# EAGLE schematic MesschieberBackup (EAGLE 6.5.0)
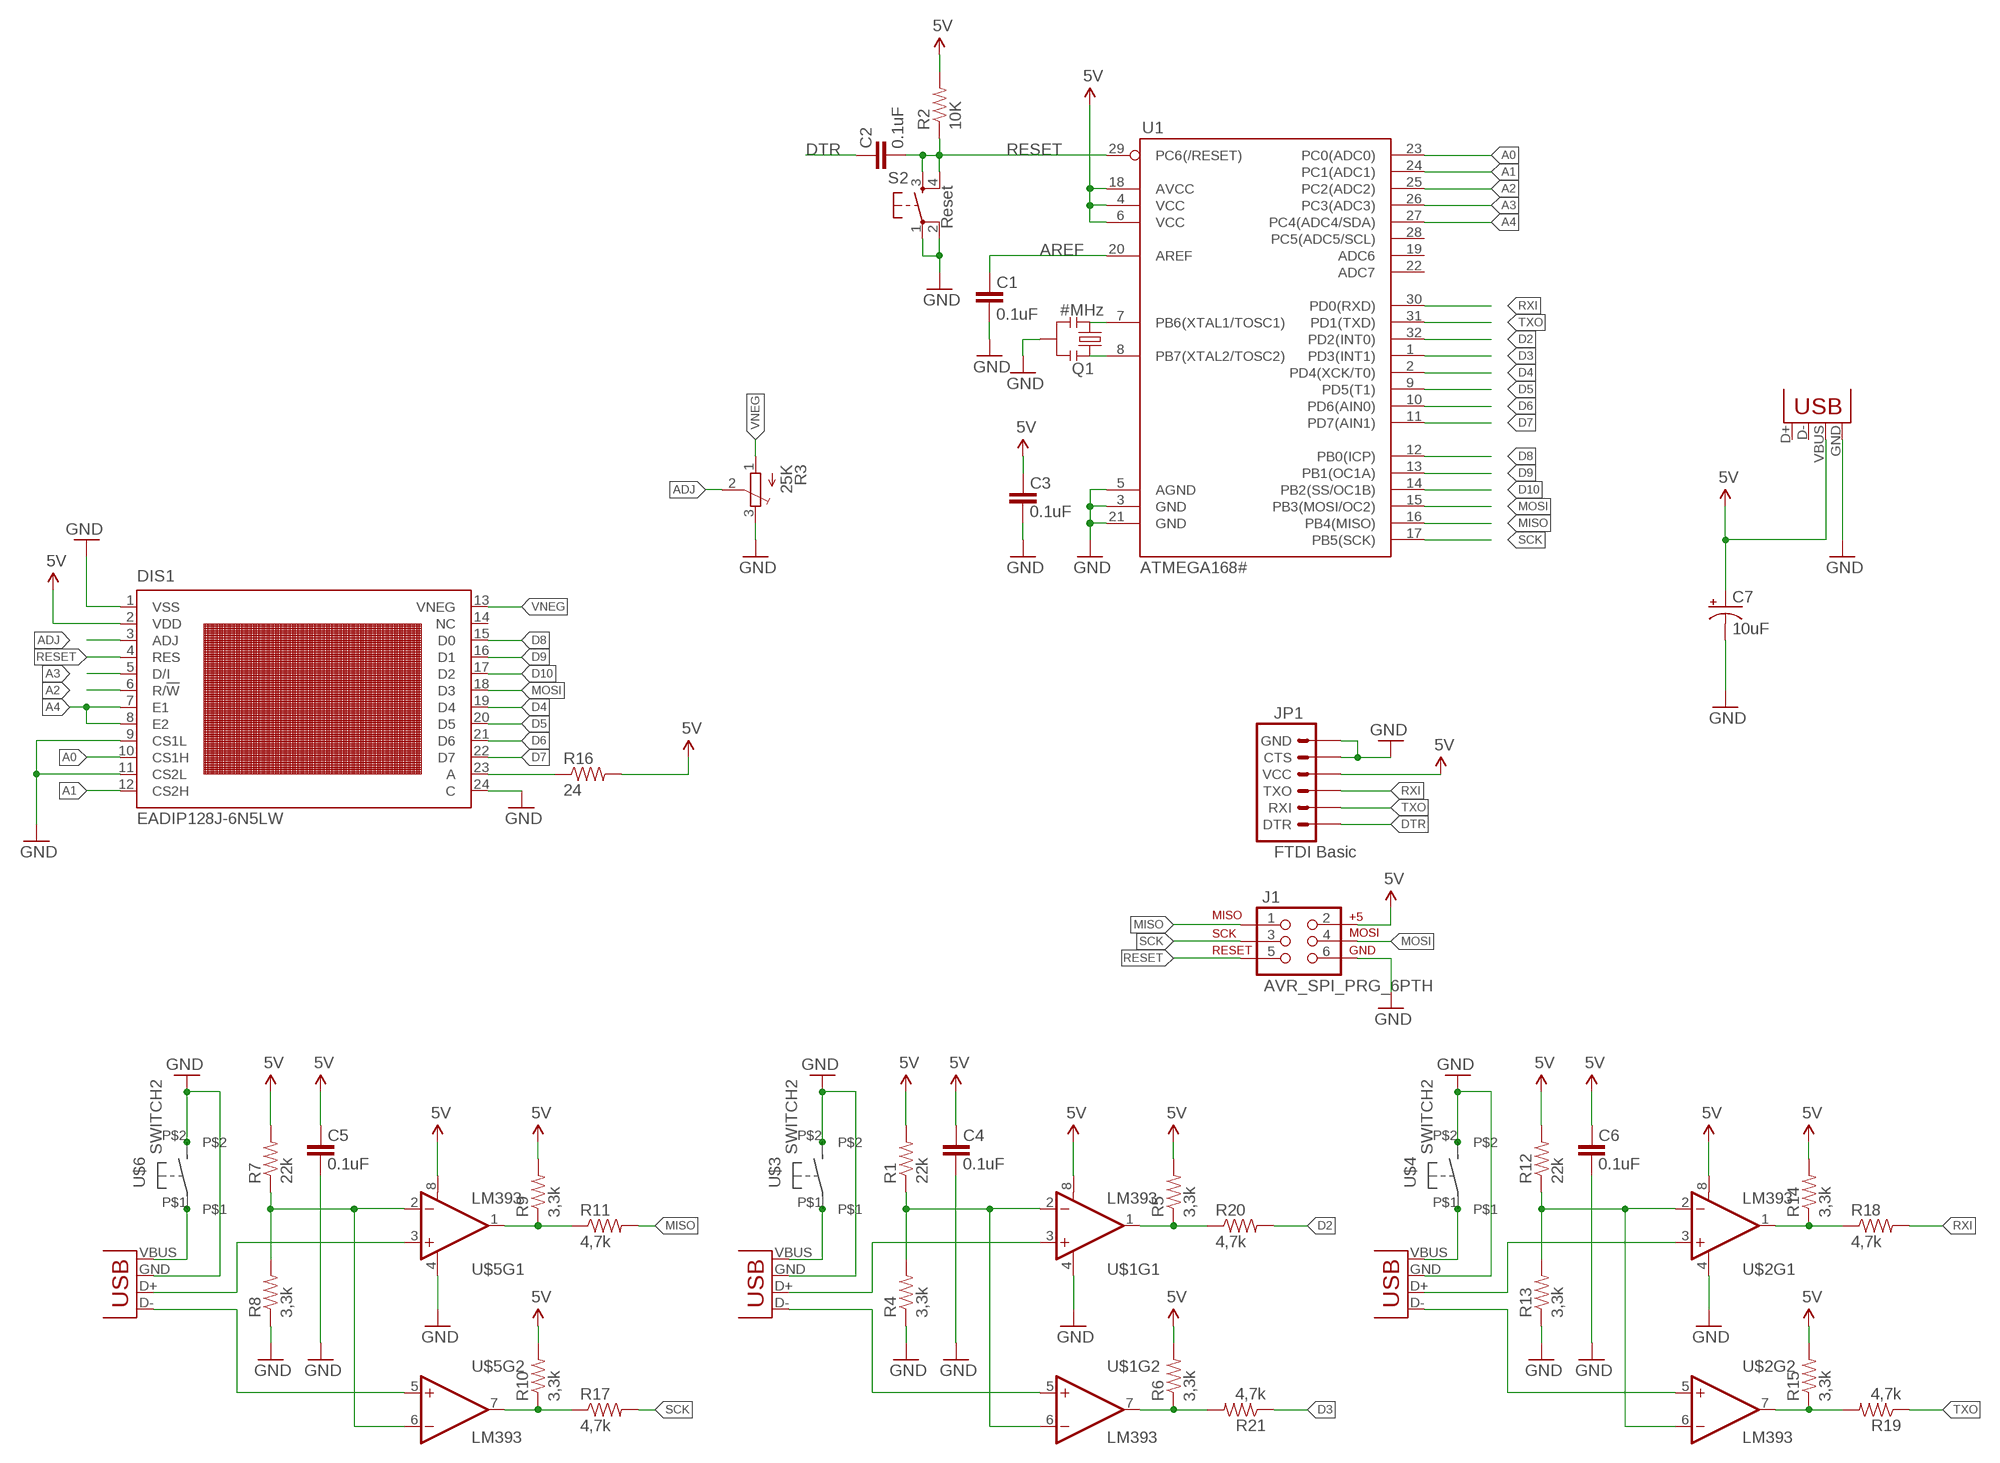
[diagram p0: schematic, sheet 1]

## Parts
C1  0.1uF  CAP0805  [0805]
C2  0.1uF  CAP0805  [0805]
C3  0.1uF  CAP0805  [0805]
C4  0.1uF  CAP0805  [0805]
C5  0.1uF  CAP0805  [0805]
C6  0.1uF  CAP0805  [0805]
C7  10uF  10UF-16V-10%(TANT)  [EIA3216]
DIS1  EADIP128J-6N5LW  [LCD-DIP128-64]
J1  AVR_SPI_PRG_6PTH  [2X3]
JP1  FTDI Basic  ARDUINO_SERIAL_PROGRAMPTH  [1X06]
JP2  USB-A-H  [USB-A-H]
JP3  USB-A-H  [USB-A-H]
JP6  USB-A-H  [USB-A-H]
JP7  USB-SMD-NS  [USB-MINIB-NOSTOP]
Q1  #MHz  RESONATORSMD  [RESONATOR-SMD]
R1  22k  RESISTOR  [0805]
R2  10K  RESISTOR  [0805]
R3  25K  TRIM_EU-SM-42/43A  [SM-42/43A]
R4  3,3k  RESISTOR  [0805]
R5  3,3k  RESISTOR  [0805]
R6  3,3k  RESISTOR  [0805]
R7  22k  RESISTOR  [0805]
R8  3,3k  RESISTOR  [0805]
R9  3,3k  RESISTOR  [0805]
R10  3,3k  RESISTOR  [0805]
R11  4,7k  RESISTOR  [0805]
R12  22k  RESISTOR  [0805]
R13  3,3k  RESISTOR  [0805]
R14  3,3k  RESISTOR  [0805]
R15  3,3k  RESISTOR  [0805]
R16  24  RESISTOR  [0805]
R17  4,7k  RESISTOR  [0805]
R18  4,7k  RESISTOR  [0805]
R19  4,7k  RESISTOR  [0805]
R20  4,7k  RESISTOR  [0805]
R21  4,7k  RESISTOR  [0805]
S2  Reset  TAC_SWITCHSND  [TACTILE_SWITCH_SMD]
U1  ATMEGA168#  ATMEGA168  [TQFP32-08]
U$1  LM393  [SO08]
U$2  LM393  [SO08]
U$3  SWITCH2  [SWITCH2]
U$4  SWITCH2  [SWITCH2]
U$5  LM393  [SO08]
U$6  SWITCH2  [SWITCH2]

## Nets
5V: C3.2 C4.2 C5.2 C6.2 C7.A(+) DIS1.2(VDD) J1.2 JP1.4(VCC) JP7.VBUS R1.2 R2.2 R5.2 R6.2 R7.2 R9.2 R10.2 R12.2 R14.2 R15.2 R16.2 U1.4(VCC) U1.6(VCC) U1.18(AVCC) U$1.8(V+) U$2.8(V+) U$5.8(V+)
A0: DIS1.10(CS1H) U1.23(PC0(ADC0))
A1: DIS1.12(CS2H) U1.24(PC1(ADC1))
A2: DIS1.6(R/!W) U1.25(PC2(ADC2))
A3: DIS1.5(D/I) U1.26(PC3(ADC3))
A4: DIS1.7(E1) DIS1.8(E2) U1.27(PC4(ADC4/SDA))
ADJ: DIS1.3(ADJ) R3.2(S)
AREF: C1.2 U1.20(AREF)
D2: R20.2 U1.32(PD2(INT0))
D3: R21.1 U1.1(PD3(INT1))
D4: DIS1.19(D4) U1.2(PD4(XCK/T0))
D5: DIS1.20(D5) U1.9(PD5(T1))
D6: DIS1.21(D6) U1.10(PD6(AIN0))
D7: DIS1.22(D7) U1.11(PD7(AIN1))
D8: DIS1.15(D0) U1.12(PB0(ICP))
D9: DIS1.16(D1) U1.13(PB1(OC1A))
D10: DIS1.17(D2) U1.14(PB2(SS/OC1B))
DATA1: R9.1 R11.1 U$5.1(OUT)
DATA2: R5.1 R20.1 U$1.1(OUT)
DATA3: R14.1 R18.1 U$2.1(OUT)
DTR: C2.2 JP1.1(DTR)
GND [vcc]: C1.1 C3.1 C4.1 C5.1 C6.1 C7.C(-) DIS1.1(VSS) DIS1.9(CS1L) DIS1.11(CS2L) DIS1.24(C) J1.6 JP1.5(CTS) JP1.6(GND) JP2.GND(VBUS) JP3.GND(VBUS) JP6.GND(VBUS) JP7.GND Q1.2 R3.3(E) R4.1 R8.1 R13.1 S2.1 S2.2 U1.3(GND) U1.5(AGND) U1.21(GND) U$1.4(V-) U$2.4(V-) U$3.P$2 U$4.P$2 U$5.4(V-) U$6.P$2
MISO: J1.1 R11.2 U1.16(PB4(MISO))
MOSI: DIS1.18(D3) J1.4 U1.15(PB3(MOSI/OC2))
N$1: Q1.1 U1.8(PB7(XTAL2/TOSC2))
N$2: Q1.3 U1.7(PB6(XTAL1/TOSC1))
N$3: R1.1 R4.2 U$1.2(-IN) U$1.6(-IN)
N$4: JP2.D+(D-) U$1.3(+IN)
N$5: JP2.D-(D+) U$1.5(+IN)
N$8: JP2.VBUS(GND) U$3.P$1
N$9: R7.1 R8.2 U$5.2(-IN) U$5.6(-IN)
N$10: JP3.D+(D-) U$5.3(+IN)
N$11: JP3.D-(D+) U$5.5(+IN)
N$14: JP3.VBUS(GND) U$6.P$1
N$15: R12.1 R13.2 U$2.2(-IN) U$2.6(-IN)
N$16: JP6.D+(D-) U$2.3(+IN)
N$17: JP6.D-(D+) U$2.5(+IN)
N$20: JP6.VBUS(GND) U$4.P$1
N$29: DIS1.23(A) R16.1
RESET: C2.1 DIS1.4(RES) J1.5 R2.1 S2.3 S2.4 U1.29(PC6(/RESET))
RXI: JP1.3(TXO) R18.2 U1.30(PD0(RXD))
SCK: J1.3 R17.2 U1.17(PB5(SCK))
SCK1: R10.1 R17.1 U$5.7(OUT)
SCK2: R6.1 R21.2 U$1.7(OUT)
SCK3: R15.1 R19.2 U$2.7(OUT)
TXO: JP1.2(RXI) R19.1 U1.31(PD1(TXD))
VNEG: DIS1.13(VNEG) R3.1(A)
Unconnected: DIS1.14(NC) JP7.D+ JP7.D- U1.19(ADC6) U1.22(ADC7) U1.28(PC5(ADC5/SCL))

## Library data of the parts
C1-C6 = SparkFun:CAP: Capacitor Standard 0603 ceramic capacitor, and 0.1" leaded capacitor.
C7 = SparkFun-Capacitors:10UF-16V-10%(TANT): CAP-00811 1206/EIA-3216 Tantalum capacitor; PROD_ID: CAP-00811
DIS1 = display-lcd:EADIP128*-6N5LW: LCD-GRAFIK MODUL 128x64 PIXEL EA DIP128-6N5LW BLAU-WEISS EA DIP128J-6N5LW SCHWARZ-WEISS ELECTRONIC ASSEMBLY GMBH LOCHHAMER SCHLAG 17 D-82166 GRÄFELFING Source: www.lcd-module.de .. dip128-6.pdf; OC_FARNELL: unknown; OC_NEWARK: unknown
J1 = SparkFun-Connectors:AVR_SPI_PRG_6: AVR ISP 6 Pin This is the reduced ISP connector for AVR programming. Common on Arduino. This footprint will take up less PCB space and can be used with a 10-pin to 6-pin adapter such as SKU: BOB-08508
JP1 = SparkFun:ARDUINO_SERIAL_PROGRAM
JP2 JP3 JP6 JP7 = SparkFun-Connectors:USB: USB Connectors USB-B-PTH is fully proven SKU : PRT-00139/CONN-08278 USB-miniB is fully proven SKU : PRT-00587 USB-A-PCB is untested. USB-A-H is throughly reviewed, but untested. Spark Fun Electronics SKU : PRT-00437 USB-B-SMT is throughly reviewed, but untested. Needs silkscreen touching up. USB-A-S has not been used/tested USB-MB-H has not been used/tested USB-MICROB has been used. CONN-09505
Q1 = SparkFun:RESONATOR: Resonator Small SMD resonator. This is the itty bitty 10/20MHz resonators with built in caps. CSTCE10M0G55 and CSTCE20M0V53. Footprint has been reviewed closely but hasn't been tested yet.
R1 R2 R4-R21 = SparkFun:RESISTOR: Resistor Basic schematic elements and footprints for 0603, 1206, and PTH 1/10th watt (small) resistors.
R3 = pot:TRIM_EU-: POTENTIOMETER
S2 = SparkFun:TAC_SWITCH: Momentary Switch Button commonly used for reset or general input. Spark Fun Electronics SKU : COM-00097
U1 = SparkFun:ATMEGA168
U$1 U$2 U$5 = SparkFun-AnalogIC:LM393: Low-voltage comparator
U$3 U$4 U$6 = andi:SWITCH2

## Net classes
0 default: width 0.203 mm, clearance 0.205 mm
1 vcc: width 0.254 mm, clearance 0.205 mm to class 0, clearance 0.205 mm